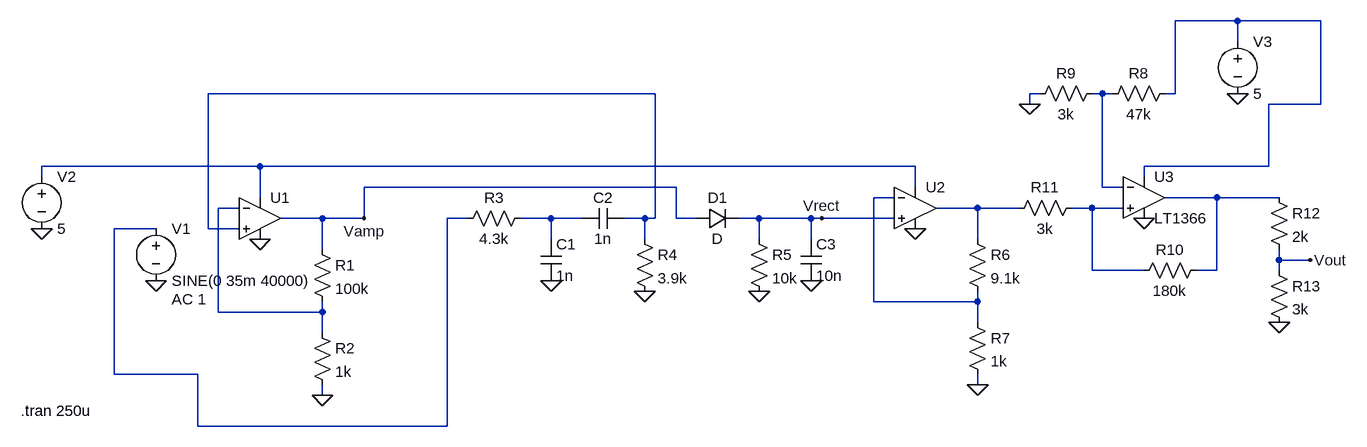
[diagram p0: schematic Ultrasonic Full Circuit FINAL FINAL.asc]
Ultrasonic Full Circuit FINAL FINAL.asc, the LTspice schematic file:
Version 4.1
SHEET 1 1588 680
WIRE 1392 -192 1296 -192
WIRE 1520 -192 1392 -192
WIRE 1392 -160 1392 -192
WIRE 496 -80 -192 -80
WIRE 1088 -80 1072 -80
WIRE 1184 -80 1168 -80
WIRE 1200 -80 1184 -80
WIRE 1296 -80 1296 -192
WIRE 1296 -80 1280 -80
WIRE 1072 -64 1072 -80
WIRE 1520 -64 1520 -192
WIRE 1520 -64 1440 -64
WIRE -112 32 -448 32
WIRE 896 32 -112 32
WIRE 1440 32 1440 -64
WIRE 1440 32 1248 32
WIRE -448 48 -448 32
WIRE 1248 48 1248 32
WIRE 528 64 48 64
WIRE 896 64 896 32
WIRE 1184 64 1184 -80
WIRE 1216 64 1184 64
WIRE -112 80 -112 32
WIRE 864 80 832 80
WIRE 1360 80 1280 80
WIRE 1456 80 1360 80
WIRE -144 96 -176 96
WIRE 992 96 928 96
WIRE 1056 96 992 96
WIRE 1168 96 1136 96
WIRE 1216 96 1168 96
WIRE -16 112 -80 112
WIRE 48 112 48 64
WIRE 48 112 -16 112
WIRE 208 112 176 112
WIRE 336 112 288 112
WIRE 384 112 336 112
WIRE 480 112 448 112
WIRE 496 112 496 -80
WIRE 496 112 480 112
WIRE 528 112 528 64
WIRE 560 112 528 112
WIRE 656 112 624 112
WIRE 736 112 656 112
WIRE 752 112 736 112
WIRE 864 112 752 112
WIRE -272 128 -336 128
WIRE -192 128 -192 -80
WIRE -144 128 -192 128
WIRE 336 144 336 112
WIRE 480 144 480 112
WIRE 656 144 656 112
WIRE 736 144 736 112
WIRE 992 144 992 96
WIRE -16 160 -16 112
WIRE 1456 176 1456 160
WIRE 1504 176 1456 176
WIRE 1168 192 1168 96
WIRE 1248 192 1168 192
WIRE 1360 192 1360 80
WIRE 1360 192 1328 192
WIRE 1456 192 1456 176
WIRE 832 240 832 80
WIRE 992 240 992 224
WIRE 992 240 832 240
WIRE -176 256 -176 96
WIRE -16 256 -16 240
WIRE -16 256 -176 256
WIRE 992 272 992 240
WIRE -16 288 -16 256
WIRE -336 352 -336 128
WIRE -208 352 -336 352
WIRE 992 368 992 352
WIRE -16 384 -16 368
WIRE -208 432 -208 352
WIRE 176 432 176 112
WIRE 176 432 -208 432
FLAG -16 384 0
FLAG 48 112 Vamp
FLAG -272 208 0
FLAG -448 128 0
FLAG -112 144 0
FLAG 480 224 0
FLAG 336 208 0
FLAG 656 224 0
FLAG 736 208 0
FLAG 752 112 Vrect
FLAG 992 368 0
FLAG 896 128 0
FLAG 1392 -80 0
FLAG 1072 -64 0
FLAG 1248 112 0
FLAG 1456 272 0
FLAG 1504 176 Vout
SYMBOL res -32 144 R0
SYMATTR InstName R1
SYMATTR Value 100k
SYMBOL res -32 272 R0
SYMATTR InstName R2
SYMATTR Value 1k
SYMBOL voltage -272 112 R0
WINDOW 123 24 124 Left 2
WINDOW 39 0 0 Left 0
SYMATTR Value2 AC 1
SYMATTR InstName V1
SYMATTR Value SINE(0 35m 40000)
SYMBOL voltage -448 32 R0
SYMATTR InstName V2
SYMATTR Value 5
SYMBOL OpAmps\\UniversalOpAmp -112 112 R0
SYMATTR InstName U1
SYMBOL res 304 96 R90
WINDOW 0 0 56 VBottom 2
WINDOW 3 32 56 VTop 2
SYMATTR InstName R3
SYMATTR Value 4.3k
SYMBOL cap 320 144 R0
SYMATTR InstName C1
SYMATTR Value 1n
SYMBOL cap 448 96 R90
WINDOW 0 0 32 VBottom 2
WINDOW 3 32 32 VTop 2
SYMATTR InstName C2
SYMATTR Value 1n
SYMBOL res 464 128 R0
SYMATTR InstName R4
SYMATTR Value 3.9k
SYMBOL diode 560 128 R270
WINDOW 0 32 32 VTop 2
WINDOW 3 0 32 VBottom 2
SYMATTR InstName D1
SYMBOL res 640 128 R0
SYMATTR InstName R5
SYMATTR Value 10k
SYMBOL cap 720 144 R0
SYMATTR InstName C3
SYMATTR Value 10n
SYMBOL res 976 128 R0
SYMATTR InstName R6
SYMATTR Value 9.1k
SYMBOL res 976 256 R0
SYMATTR InstName R7
SYMATTR Value 1k
SYMBOL OpAmps\\UniversalOpAmp 896 96 R0
SYMATTR InstName U2
SYMBOL voltage 1392 -176 R0
SYMATTR InstName V3
SYMATTR Value 5
SYMBOL res 1296 -96 R90
WINDOW 0 0 56 VBottom 2
WINDOW 3 32 56 VTop 2
SYMATTR InstName R8
SYMATTR Value 47k
SYMBOL res 1184 -96 R90
WINDOW 0 0 56 VBottom 2
WINDOW 3 32 56 VTop 2
SYMATTR InstName R9
SYMATTR Value 3k
SYMBOL res 1344 176 R90
WINDOW 0 0 56 VBottom 2
WINDOW 3 32 56 VTop 2
SYMATTR InstName R10
SYMATTR Value 180k
SYMBOL res 1152 80 R90
WINDOW 0 0 56 VBottom 2
WINDOW 3 32 56 VTop 2
SYMATTR InstName R11
SYMATTR Value 3k
SYMBOL OpAmps\\LT1366 1248 16 R0
SYMATTR InstName U3
SYMBOL res 1440 64 R0
SYMATTR InstName R12
SYMATTR Value 2k
SYMBOL res 1440 176 R0
SYMATTR InstName R13
SYMATTR Value 3k
TEXT -480 408 Left 2 !.tran 250u

The netlist it stands for:
* Ultrasonic Full Circuit FINAL FINAL.asc
R1 Vamp N007 100k
R2 N007 0 1k
V1 N010 0 SINE(0 35m 40000) AC 1
V2 N004 0 5
X§U1 N002 N007 N004 0 Vamp level1 Avol=1Meg GBW=10Meg Vos=0 En=0 Enk=0 In=0 Ink=0 Rin=500Meg  ; pins In+ In- V+ V- OUT
R3 N011 N010 4.3k
C1 N011 0 1n
C2 N002 N011 1n
R4 N002 0 3.9k
D1 Vamp Vrect D
R5 Vrect 0 10k
C3 Vrect 0 10n
R6 N008 N005 9.1k
R7 N005 0 1k
X§U2 Vrect N005 N004 0 N008 level1 Avol=1Meg GBW=10Meg Vos=0 En=0 Enk=0 In=0 Ink=0 Rin=500Meg  ; pins In+ In- V+ V- OUT
V3 N001 0 5
R8 N001 N003 47k
R9 N003 0 3k
R10 N006 N009 180k
R11 N009 N008 3k
X§U3 N009 N003 N001 0 N006 LT1366  ; pins In+ In- V+ V- OUT
R12 N006 Vout 2k
R13 Vout 0 3k
.model D D
.lib standard.dio
.tran 250u
.lib UniversalOpAmp1.lib
.lib LTC.lib
.backanno
.end